# Altium project usb_smt.PRJPCB
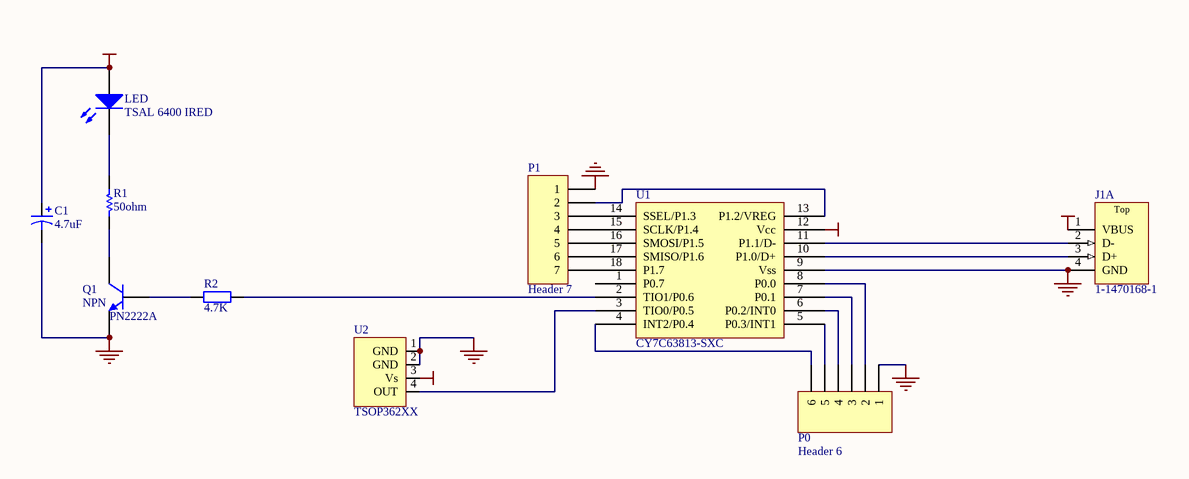
[diagram p0: usb_smt.SCHDOC]
1 sheet, 10 parts. Net scope: global (net labels, ports and power ports of the same name join across sheets).
Board file: usb_smt.PCBDOC

## Sheet usb_smt.SCHDOC
size A

### Parts
C1  value 4.7uF  [TC3216-1206]  (hidden comment: Cap Pol1)
J1  1-1470168-1  [1470695]  (part A of 3)
LED  TSAL 6400 IRED  [LED]
P0  Header 6  [HDR1X6]
P1  Header 7  [HDR1X7]
Q1  NPN  [SO-G3/D4.1]
R1  50ohm  [CR1608-0603]
R2  value 4.7K  [CR1608-0603]  (hidden comment: Res2)
U1  CY7C63813-SXC  [SO-G18/E6.2]
U2  TSOP362XX  [TSOP 362XX]

### Nets
GND: C1.2 J1.4(GND) P0.1 P1.1 Q1.3(E) U1.9(Vss) U2.1(GND) U2.2(GND)
VCC: C1.1 J1.1(VBUS) LED.1(A) U1.12(Vcc) U2.3(Vs)
NetJ1_2: J1.2(D-) U1.11(P1.1/D-)
NetJ1_3: J1.3(D+) U1.10(P1.0/D+)
NetLED_2: LED.2(K) R1.2
NetP0_2: P0.2 U1.8(P0.0)
NetP0_3: P0.3 U1.7(P0.1)
NetP0_4: P0.4 U1.6(P0.2/INT0)
NetP0_5: P0.5 U1.5(P0.3/INT1)
NetP0_6: P0.6 U1.4(INT2/P0.4)
NetP1_2: P1.2 U1.13(P1.2/VREG)
NetP1_3: P1.3 U1.14(SSEL/P1.3)
NetP1_4: P1.4 U1.15(SCLK/P1.4)
NetP1_5: P1.5 U1.16(SMOSI/P1.5)
NetP1_6: P1.6 U1.17(SMISO/P1.6)
NetP1_7: P1.7 U1.18(P1.7)
NetQ1_1: Q1.1(C) R1.1
NetQ1_2: Q1.2(B) R2.2
NetR2_1: R2.1 U1.2(TIO1/P0.6)
NetU1_3: U1.3(TIO0/P0.5) U2.4(OUT)

Not connected (* = marked no-connect by the designer): U1 1(P0.7)

### Notes on the sheet
- (near Q1) PN2222A
- (in symbol 1-1470168-1, part A) Top

### Library data of the parts
C1 = Cap Pol1: Polarized Capacitor (Radial); Published: 8-Jun-2000; LatestRevisionDate: 17-Jul-2002; LatestRevisionNote: Re-released for DXP Platform.; Publisher: Altium Limited
J1 = 1-1470168-1: USB 1.1, Right Angle, Thru-Hole, A Type, Receptacle, 4x4 Position, Stacked, Black; ContactMaterial: Copper Alloy; ContactPlating: Gold Flash; TerminationLength: 3.18mm [0.125in.]; PCB_Layout: Complies with manufacturer's recommendation.; DrillSize: Corresponds to nominal value.; PanelGround: With; Published: 15-Jul-2004; DatasheetDocument: 15-Aug-2002; PackageDocument: 15-Aug-2002; PackageReference: 1470168; Publisher: Altium Limited; HousingMaterial: Glass-Filled Thermoplastic
LED = LED0: Typical INFRARED GaAs LED; Published: 8-Jun-2000; LatestRevisionDate: 17-Jul-2002; LatestRevisionNote: Re-released for DXP Platform.; Publisher: Altium Limited
P0 = Header 6: Header, 6-Pin; LatestRevisionDate: 17-Jul-2002; LatestRevisionNote: Re-released for DXP Platform.; Publisher: Altium Limited
P1 = Header 7: Header, 7-Pin; LatestRevisionDate: 17-Jul-2002; LatestRevisionNote: Re-released for DXP Platform.; Publisher: Altium Limited
Q1 = NPN: NPN Bipolar Transistor; Published: 8-Jun-2000; LatestRevisionDate: 17-Jul-2002; LatestRevisionNote: Re-released for DXP Platform.; Publisher: Altium Limited; Code_JEDEC: TO-226-AA
R1 = Res Semi: Semiconductor Resistor; Published: 8-Jun-2000; LatestRevisionDate: 17-Jul-2002; LatestRevisionNote: Re-released for DXP Platform.; Publisher: Altium Limited; Value: 50ohm
R2 = Res2: Resistor; Published: 8-Jun-2000; LatestRevisionDate: 17-Jul-2002; LatestRevisionNote: Re-released for DXP Platform.; Publisher: Altium Limited
U1 = CY7C63813-SXC: USB microcontroller, SMT
U2 = TSOP36238